# EAGLE schematic schema (EAGLE 7.6.0)
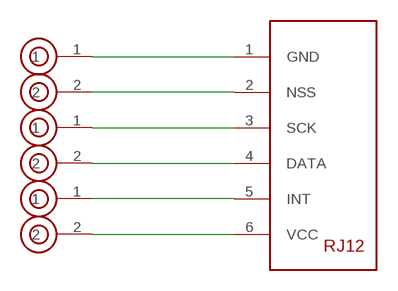
[diagram p0: schematic, sheet 1]

## Parts
U$1  RJ12SMD  [RJ12_SMD]
U$4  GOLDPIN_2  [GOLDPIN_2_SMD]
U$5  GOLDPIN_2  [GOLDPIN_2_SMD]
U$6  GOLDPIN_2  [GOLDPIN_2_SMD]

## Nets
N$1: U$1.1(GND) U$6.1
N$2: U$1.2(NSS) U$6.2
N$3: U$1.3(SCK) U$5.1
N$4: U$1.4(DATA) U$5.2
N$5: U$1.5(INT) U$4.1
N$6: U$1.6(VCC) U$4.2

## Library data of the parts
U$1 = gumyns:RJ12
U$4-U$6 = gumyns:GOLDPIN_2